# Altium schematic sheet BF24.SchDoc
size A4
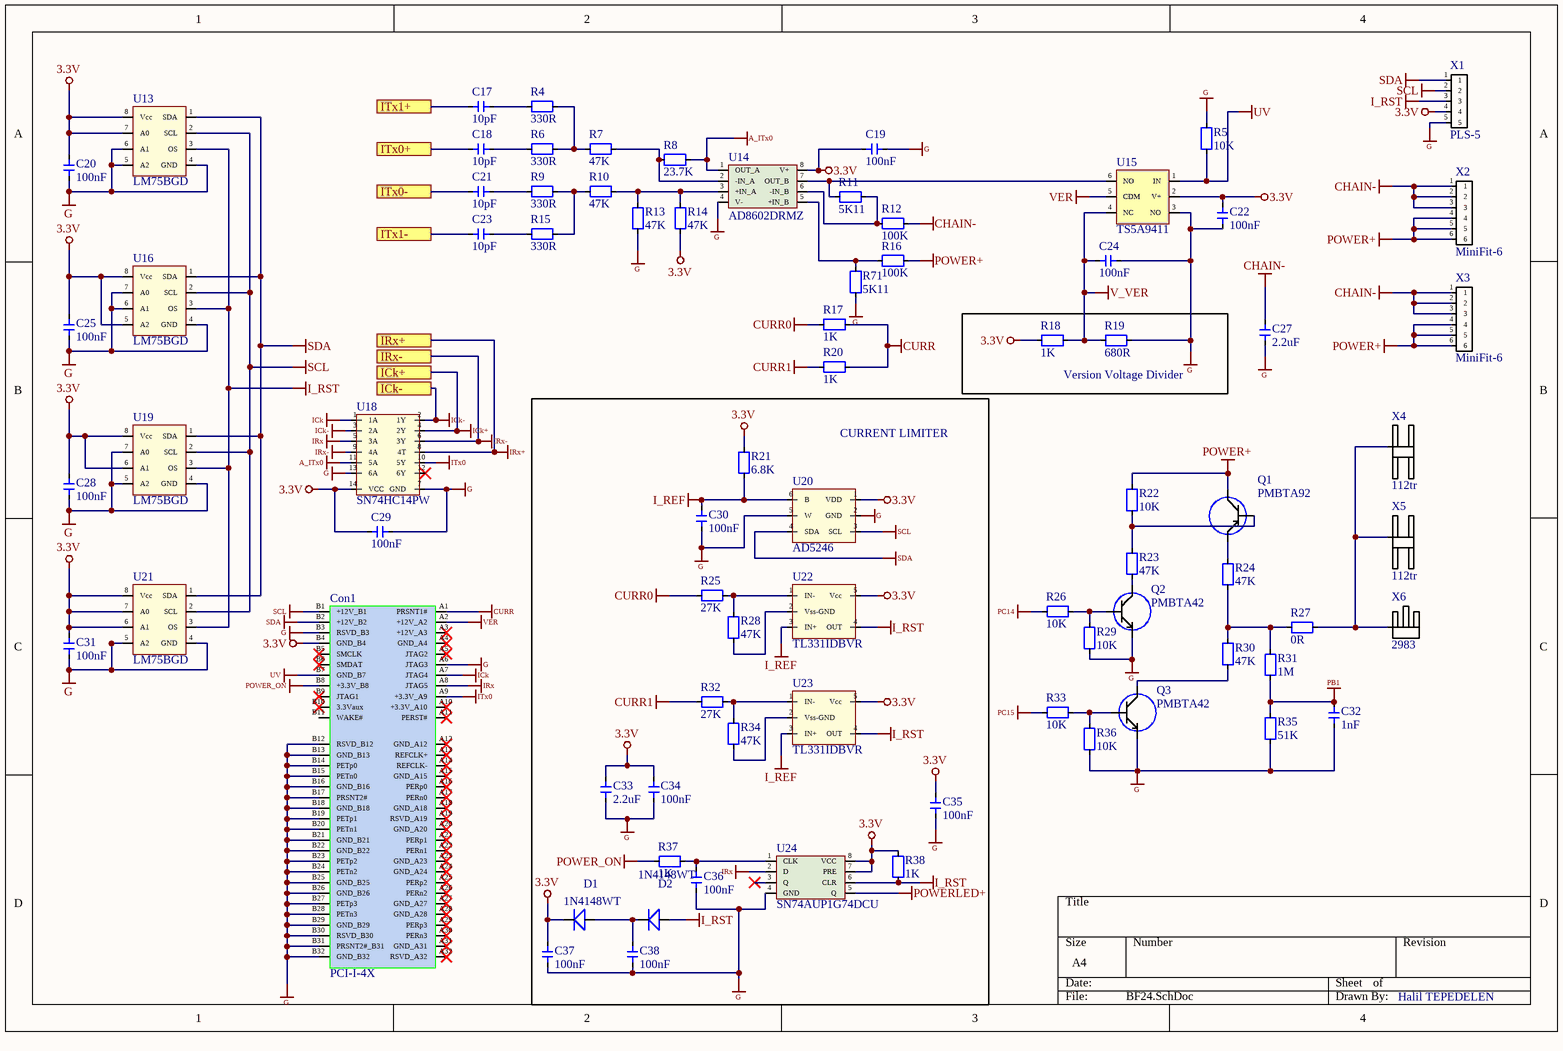
[diagram p0: BF24.SchDoc]

## Parts
C17  10pF  [C-0402R]
C18  10pF  [C-0402R]
C19  100nF  [C-0402R]
C20  100nF  [C-0603W]
C21  10pF  [C-0402R]
C22  100nF  [C-0402R]
C23  10pF  [C-0402R]
C24  100nF  [C-0402R]
C25  100nF  [C-0603W]
C27  2.2uF  [R-1210R]
C28  100nF  [C-0603W]
C29  100nF  [C-0402R]
C30  100nF  [C-0402R]
C31  100nF  [C-0603W]
C32  1nF  [C-0603W]
C33  2.2uF  [C-0402R]
C34  100nF  [C-0402R]
C35  100nF  [C-0402R]
C36  100nF  [C-0402R]
C37  100nF  [C-0402R]
C38  100nF  [C-0402R]
Con1  PCI-I-4X  [SAMTEC_PCIE-064-02-X-D-EMS2]
D1  1N4148WT  [1n4148]
D2  1N4148WT  [1n4148]
Q1  PMBTA92  [pmbta92]
Q2  PMBTA42  [pmbta42]
Q3  PMBTA42  [pmbta42]
R4  330R  [R-0402R]
R5  10K  [R-0402R]
R6  330R  [R-0402R]
R7  47K  [R-0402R]
R8  23.7K  [R-0402R]
R9  330R  [R-0402R]
R10  47K  [R-0402R]
R11  5K11  [R-0603W]
R12  100K  [R-0603W]
R13  47K  [R-0402R]
R14  47K  [R-0402R]
R15  330R  [R-0402R]
R16  100K  [R-0603W]
R17  1K  [R-0402R]
R18  1K  [R-0402R]
R19  680R  [R-0402R]
R20  1K  [R-0402R]
R21  6.8K  [R-0402R]
R22  10K  [R-0603W]
R23  47K  [R-1206W]
R24  47K  [R-1206W]
R25  27K  [R-0402R]
R26  10K  [R-0603W]
R27  0R  [R-0402R]
R28  47K  [R-0402R]
R29  10K  [R-0603W]
R30  47K  [R-1206W]
R31  1M  [R-0402R]
R32  27K  [R-0402R]
R33  10K  [R-0603W]
R34  47K  [R-0402R]
R35  51K  [R-0603W]
R36  10K  [R-0603W]
R37  1K  [R-0402R]
R38  1K  [R-0402R]
R71  5K11  [R-0603W]
U13  LM75BGD  [lm75]
U14  AD8602DRMZ  [ad860]
U15  TS5A9411  [ts5a9411]
U16  LM75BGD  [lm75]
U18  SN74HC14PW  [sn74hcpw]
U19  LM75BGD  [lm75]
U20  AD5246  [ad5246]
U21  LM75BGD  [lm75]
U22  TL331IDBVR  [tl331]
U23  TL331IDBVR  [tl331]
U24  SN74AUP1G74DCU  [sn74aup]
X1  PLS-5  [5pinCon]
X2  MiniFit-6  [MiniFit 6]
X3  MiniFit-6  [MiniFit 6]
X4  112tr  [112tr]
X5  112tr  [112tr]
X6  2983  [2983]

## Blocks framed on the sheet
Version Voltage Divider: R18 R19

## Ports
ICk+, ICk-, IRx+, IRx-, ITx0+, ITx0-, ITx1+, ITx1-

## Nets
3.3V: C19.1 C20.2 C22.2 C25.2 C28.2 C29.1 C31.2 C33.2 C34.2 C35.2 C37.2 Con1.B4(GND_B4) D1.1 R14.1 R18.1 R21.2 R38.2 U13.7(A0) U13.8(Vcc) U14.8(V+) U15.2(V+) U16.5(A2) U16.8(Vcc) U18.14(VCC) U19.6(A1) U19.8(Vcc) U20.1(VDD) U21.6(A1) U21.7(A0) U21.8(Vcc) U22.5(Vcc) U23.5(Vcc) U24.7(PRE) U24.8(VCC) X1.4
A_ITx0: R8.2 U14.1(OUT_A) U18.11(5A)
CHAIN-: C27.2 R12.2 X2.1 X2.2 X2.3 X3.1 X3.2 X3.3
CURR: Con1.A1(PRSNT1#) R17.2 R20.2
CURR0: R17.1 R25.1
CURR1: R20.1 R32.1
G: C19.2 C20.1 C22.1 C24.2 C25.1 C27.1 C28.1 C29.2 C30.1 C31.1 C32.1 C33.1 C34.1 C35.1 C36.1 C37.1 C38.1 Con1.A6(JTAG3) Con1.B3(RSVD_B3) Con1.B12(RSVD_B12) Con1.B13(GND_B13) Con1.B14(PETp0) Con1.B15(PETn0) Con1.B16(GND_B16) Con1.B17(PRSNT2#) Con1.B18(GND_B18) Con1.B19(PETp1) Con1.B20(PETn1) Con1.B21(GND_B21) Con1.B22(GND_B22) Con1.B23(PETp2) Con1.B24(PETn2) Con1.B25(GND_B25) Con1.B26(GND_B26) Con1.B27(PETp3) Con1.B28(PETn3) Con1.B29(GND_B29) Con1.B30(RSVD_B30) Con1.B31(PRSNT2#_B31) Con1.B32(GND_B32) Q2.2 Q3.2 R5.2 R13.1 R19.2 R29.1 R35.1 R36.1 R71.1 U13.4(GND) U13.5(A2) U13.6(A1) U14.4(V-) U15.3(NO) U16.4(GND) U16.6(A1) U16.7(A0) U18.7(GND) U18.13(6A) U19.4(GND) U19.5(A2) U19.7(A0) U20.2(GND) U20.5(W) U21.4(GND) U21.5(A2) U24.4(GND) X1.5
I_REF: C30.2 R21.1 U20.6(B) U22.3(IN+) U23.3(IN+)
I_RST: D2.2 R38.1 U13.3(OS) U16.3(OS) U19.3(OS) U21.3(OS) U22.4(OUT) U23.4(OUT) U24.6(CLR) X1.3
ICk: Con1.A7(JTAG4) U18.1(1A)
ICk+: U18.4(2Y) ; port ICk+
ICk-: U18.2(1Y) U18.3(2A) ; port ICk-
IRx: Con1.A8(JTAG5) U18.5(3A) U24.2(D)
IRx+: U18.8(4T) ; port IRx+
IRx-: U18.6(3Y) U18.9(4A) ; port IRx-
ITx0: Con1.A9(+3.3V_A9) U18.10(5Y)
PB1: C32.2 R31.1 R35.2
PC14: R26.1
PC15: R33.1
POWER+: Q1.2 R16.2 R22.2 X2.4 X2.5 X2.6 X3.4 X3.5 X3.6
POWER_ON: Con1.B8(+3.3V_B8) R37.1
POWERLED+: U24.5(Q)
SCL: Con1.B1(+12V_B1) U13.2(SCL) U16.2(SCL) U19.2(SCL) U20.3(SCL) U21.2(SCL) X1.2
SDA: Con1.B2(+12V_B2) U13.1(SDA) U16.1(SDA) U19.1(SDA) U20.4(SDA) U21.1(SDA) X1.1
UV: Con1.B7(GND_B7) R5.1 U15.1(IN)
V_VER: C24.1 R18.2 R19.1 U15.4(NC)
VER: Con1.A2(+12V_A2) U15.5(CDM)
ITx0+: C18.1 ; port ITx0+
ITx0-: C21.1 ; port ITx0-
ITx1+: C17.1 ; port ITx1+
ITx1-: C23.1 ; port ITx1-
NetC17_2: C17.2 R4.1
NetC18_2: C18.2 R6.1
NetC21_2: C21.2 R9.1
NetC23_2: C23.2 R15.1
NetC36_2: C36.2 R37.2 U24.1(CLK)
NetC38_2: C38.2 D1.2 D2.1
NetQ1_1: Q1.1 R22.1 R23.2
NetQ1_3: Q1.3 R24.2
NetQ2_1: Q2.1 R26.2 R29.2
NetQ2_3: Q2.3 R23.1
NetQ3_1: Q3.1 R33.2 R36.2
NetQ3_3: Q3.3 R30.1
NetR4_2: R4.2 R6.2 R7.1
NetR7_2: R7.2 R8.1 U14.2(-IN_A)
NetR9_2: R9.2 R10.1 R15.2
NetR10_2: R10.2 R13.2 R14.2 U14.3(+IN_A)
NetR11_1: R11.1 U14.7(OUT_B) U15.6(NO)
NetR11_2: R11.2 R12.1 U14.6(-IN_B)
NetR16_1: R16.1 R71.2 U14.5(+IN_B)
NetR24_1: R24.1 R27.1 R30.2 R31.2
NetR25_2: R25.2 R28.2 U22.1(IN-)
NetR27_2: R27.2 X4.1 X5.1 X6.1
NetR28_1: R28.1 U22.2(Vss-GND)
NetR32_2: R32.2 R34.2 U23.1(IN-)
NetR34_1: R34.1 U23.2(Vss-GND)

Not connected (* = marked no-connect by the designer): Con1 A3(+12V_A3)* A4(GND_A4)* A5(JTAG2)* A10(+3.3V_A10)* A11(PERST#)* A12(GND_A12)* A13(REFCLK+)* A14(REFCLK-)* A15(GND_A15)* A16(PERp0)* A17(PERn0)* A18(GND_A18)* A19(RSVD_A19)* A20(GND_A20)* A21(PERp1)* A22(PERn1)* A23(GND_A23)* A24(GND_A24)* A25(PERp2)* A26(PERn2)* A27(GND_A27)* A28(GND_A28)* A29(PERp3)* A30(PERn3)* A31(GND_A31)* A32(RSVD_A32)* B5(SMCLK)* B6(SMDAT)* B9(JTAG1)* B10(3.3Vaux)* B11(WAKE#); U18 12(6Y)*; U24 3(Q)*

## Notes on the sheet
- CURRENT LIMITER
- Halil TEPEDELEN

## Library data of the parts
C17 C18 C21 C23 = 10pF 0402
C19 C22 C24 C29 C30 C34-C38 = 100nF 0402
C20 C25 C28 C31 = 100nF 0603
C27 = 2.2uF 1210
C32 = 1nF 0603
C33 = 2.2uF 0402
R4 R6 R9 R15 = 330R 0402
R5 = 10K 0402
R7 R10 R13 R14 R28 R34 = 47K 0402
R8 = 23.7K 0402
R11 R71 = 5K11 0603
R12 R16 = 100k 0603
R17 R18 R20 R37 R38 = 1K 0402
R19 = 680R 0402
R21 = 6.8K 0402
R22 R26 R29 R33 R36 = 10K 0603
R23 R24 R30 = 47K 1206
R25 R32 = 27K 0402
R27 = 0R 1206
R31 = 1M 1206
R35 = 51K 0603